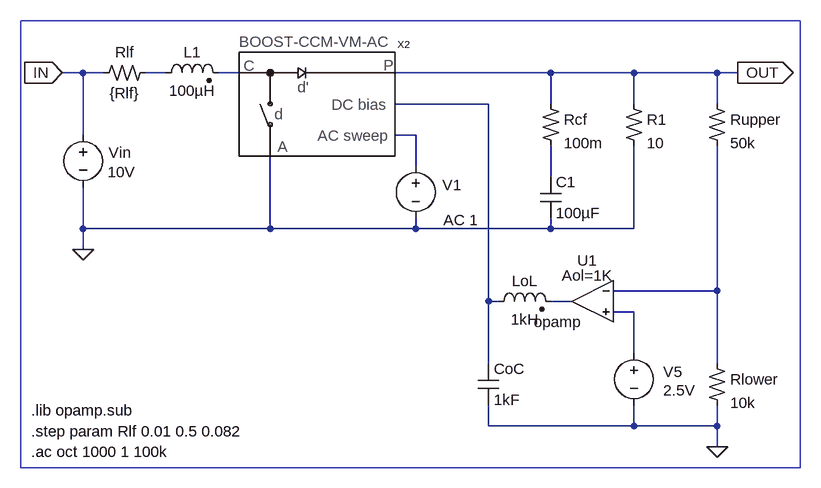
[diagram p0: schematic Switch-Mode Power Supplies - Basso- Figure 2-36.asc]
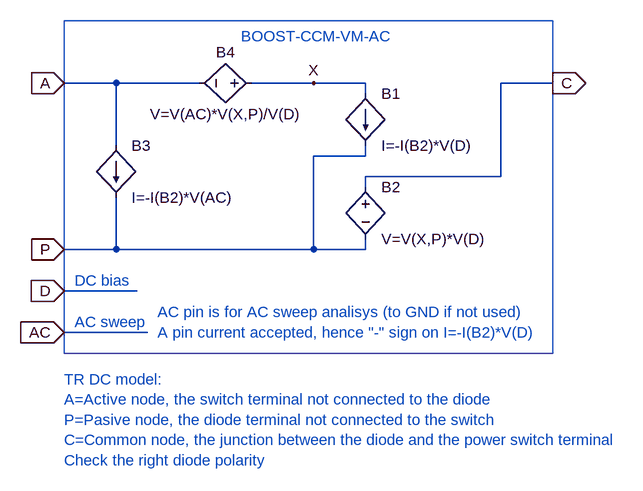
[diagram p1: sub-circuit boost-ccm-vm-ac.asc]
Switch-Mode Power Supplies - Basso- Figure 2-36.asc, the LTspice schematic file:
Version 4
SHEET 1 1220 1876
WIRE -416 -32 -448 -32
WIRE -384 -32 -416 -32
WIRE -288 -32 -320 -32
WIRE -176 -32 -208 -32
WIRE 304 -32 64 -32
WIRE 432 -32 304 -32
WIRE 560 -32 432 -32
WIRE 592 -32 560 -32
WIRE 208 16 64 16
WIRE 304 16 304 -32
WIRE 432 16 432 -32
WIRE 560 16 560 -32
WIRE -416 64 -416 -32
WIRE 96 64 64 64
WIRE 96 112 96 64
WIRE 304 128 304 80
WIRE -416 208 -416 144
WIRE -128 208 -128 96
WIRE -128 208 -416 208
WIRE 96 208 96 192
WIRE 96 208 -128 208
WIRE 304 208 304 192
WIRE 304 208 96 208
WIRE 432 208 432 80
WIRE 432 208 304 208
WIRE -416 240 -416 208
WIRE 560 304 560 80
WIRE 560 304 400 304
WIRE 208 320 208 16
WIRE 224 320 208 320
WIRE 336 320 304 320
WIRE 432 336 400 336
WIRE 432 400 432 336
WIRE 208 416 208 320
WIRE 560 416 560 304
WIRE 208 512 208 480
WIRE 432 512 432 480
WIRE 432 512 208 512
WIRE 560 512 560 480
WIRE 560 512 432 512
WIRE 560 544 560 512
FLAG -416 240 0
FLAG 592 -32 OUT
IOPIN 592 -32 Out
FLAG -448 -32 IN
IOPIN -448 -32 In
FLAG 560 544 0
SYMBOL voltage -416 48 R0
WINDOW 123 0 0 Left 0
WINDOW 39 0 0 Left 0
WINDOW 0 39 43 Left 0
WINDOW 3 38 73 Left 0
SYMATTR InstName Vin
SYMATTR Value 10V
SYMBOL ind2 -304 -16 R270
WINDOW 0 32 56 VTop 0
WINDOW 3 4 56 VBottom 0
SYMATTR InstName L1
SYMATTR Value 100µH
SYMBOL res2 -320 -48 R90
WINDOW 0 0 32 VBottom 0
WINDOW 3 32 32 VTop 0
SYMATTR InstName Rlf
SYMATTR Value {Rlf}
SYMBOL res2 544 16 R0
SYMATTR InstName Rupper
SYMATTR Value 50k
SYMBOL cap 192 416 R0
SYMATTR InstName CoC
SYMATTR Value 1kF
SYMBOL voltage 96 96 R0
WINDOW 123 43 99 Left 0
WINDOW 39 0 0 Left 0
WINDOW 0 41 45 Left 0
WINDOW 3 43 71 Left 0
SYMATTR Value2 AC 1
SYMATTR InstName V1
SYMATTR Value ""
SYMBOL res2 288 16 R0
SYMATTR InstName Rcf
SYMATTR Value 100m
SYMBOL cap 288 128 R0
SYMATTR InstName C1
SYMATTR Value 100µF
SYMBOL res2 416 16 R0
SYMATTR InstName R1
SYMATTR Value 10
SYMBOL res2 544 416 R0
SYMATTR InstName Rlower
SYMATTR Value 10k
SYMBOL voltage 432 384 R0
WINDOW 123 0 0 Left 0
WINDOW 39 0 0 Left 0
WINDOW 0 45 45 Left 0
WINDOW 3 45 73 Left 0
SYMATTR InstName V5
SYMATTR Value 2.5V
SYMBOL ind2 208 336 R270
WINDOW 0 32 56 VTop 0
WINDOW 3 4 56 VBottom 0
SYMATTR InstName LoL
SYMATTR Value 1kH
SYMBOL Opamps\\opamp 368 256 M0
WINDOW 0 23 1 Right 0
WINDOW 39 47 24 Right 0
SYMATTR InstName U1
SYMATTR SpiceLine Aol=1K
SYMBOL BOOST-CCM-VM-AC 0 0 R0
SYMATTR InstName X2
TEXT -496 552 Left 0 !.ac oct 1000 1 100k
TEXT -496 488 Left 0 !.lib opamp.sub
TEXT -496 520 Left 0 !.step param Rlf 0.01 0.5 0.082
RECTANGLE Normal 688 576 -512 -112

boost-ccm-vm-ac.asc, the sub-circuit schematic file:
Version 4
SHEET 1 944 680
WIRE 32 32 -48 32
WIRE 160 32 32 32
WIRE 336 32 240 32
WIRE 416 32 336 32
WIRE 704 32 624 32
WIRE 416 48 416 32
WIRE 32 128 32 32
WIRE 416 144 416 128
WIRE 416 144 336 144
WIRE 624 176 624 32
WIRE 624 176 416 176
WIRE 416 192 416 176
WIRE 32 288 32 208
WIRE 32 288 -48 288
WIRE 336 288 336 144
WIRE 336 288 32 288
WIRE 416 288 416 272
WIRE 416 288 336 288
WIRE 64 352 -48 352
WIRE 80 416 -48 416
FLAG -48 32 A
IOPIN -48 32 In
FLAG -48 288 P
IOPIN -48 288 In
FLAG 704 32 C
IOPIN 704 32 Out
FLAG -48 352 D
IOPIN -48 352 In
FLAG -48 416 AC
IOPIN -48 416 In
FLAG 336 32 X
SYMBOL bi 416 48 R0
SYMATTR InstName B1
SYMATTR Value I=-I(B2)*V(D)
SYMBOL bv 416 176 R0
SYMATTR InstName B2
SYMATTR Value V=V(X,P)*V(D)
SYMBOL bv 256 32 R90
WINDOW 0 -32 56 VBottom 0
WINDOW 3 32 56 VTop 0
SYMATTR InstName B4
SYMATTR Value V=V(AC)*V(X,P)/V(D)
SYMBOL bi 32 128 R0
SYMATTR InstName B3
SYMATTR Value I=-I(B2)*V(AC)
TEXT 224 -40 Left 0 ;BOOST-CCM-VM-AC
TEXT 96 416 Left 0 ;A pin current accepted, hence "-" sign on I=-I(B2)*V(D)
TEXT -48 488 Left 0 ;TR DC model:\nA=Active node, the switch terminal not connected to the diode\nP=Pasive node, the diode terminal not connected to the switch\nC=Common node, the junction between the diode and the power switch terminal\nCheck the right diode polarity
TEXT -32 400 Left 0 ;AC sweep
TEXT -32 336 Left 0 ;DC bias
TEXT 96 384 Left 0 ;AC pin is for AC sweep analisys (to GND if not used)
RECTANGLE Normal 704 448 -48 -64

The netlist it stands for:
* Switch-Mode Power Supplies - Basso- Figure 2-36.asc
Vin IN 0 10V
L1 N001 N002 100µH
Rlf N001 IN {Rlf}
Rupper OUT N006 50k
CoC N003 0 1kF
V1 N004 0 AC 1
Rcf OUT N005 100m
C1 N005 0 100µF
R1 OUT 0 10
Rlower N006 0 10k
V5 N008 0 2.5V
LoL N003 N007 1kH
XU1 N006 N008 N007 opamp Aol=1K GBW=10Meg  ; pins invin noninvin out
XX2 0 OUT N003 N002 N004 boost-ccm-vm-ac

* block symbol definitions
.subckt boost-ccm-vm-ac A P D C AC
B1 X P I=-I(B2)*V(D)
B2 C P V=V(X,P)*V(D)
B4 X A V=V(AC)*V(X,P)/V(D)
B3 A P I=-I(B2)*V(AC)
* BOOST-CCM-VM-AC
* A pin current accepted, hence "-" sign on I=-I(B2)*V(D)
* TR DC model:
* A=Active node, the switch terminal not connected to the diode
* P=Pasive node, the diode terminal not connected to the switch
* C=Common node, the junction between the diode and the power switch terminal
* Check the right diode polarity
* AC sweep
* DC bias
* AC pin is for AC sweep analisys (to GND if not used)
.ends boost-ccm-vm-ac

.ac oct 1000 1 100k
.lib opamp.sub
.step param Rlf 0.01 0.5 0.082
.backanno
.end